# EasyEDA Pro project esp32-dev-board-v1.1.eprj

# Schematic Schematic1
Board Name: Board1; Create Date: 2025-04-14; Page Name: P1; Project Name: esp32-dev-board-v1.1; Schematic Name: Schematic1; Update Date: 2025-04-22; Company: 嘉立创EDA; Page Size: A4; Version: V1.0
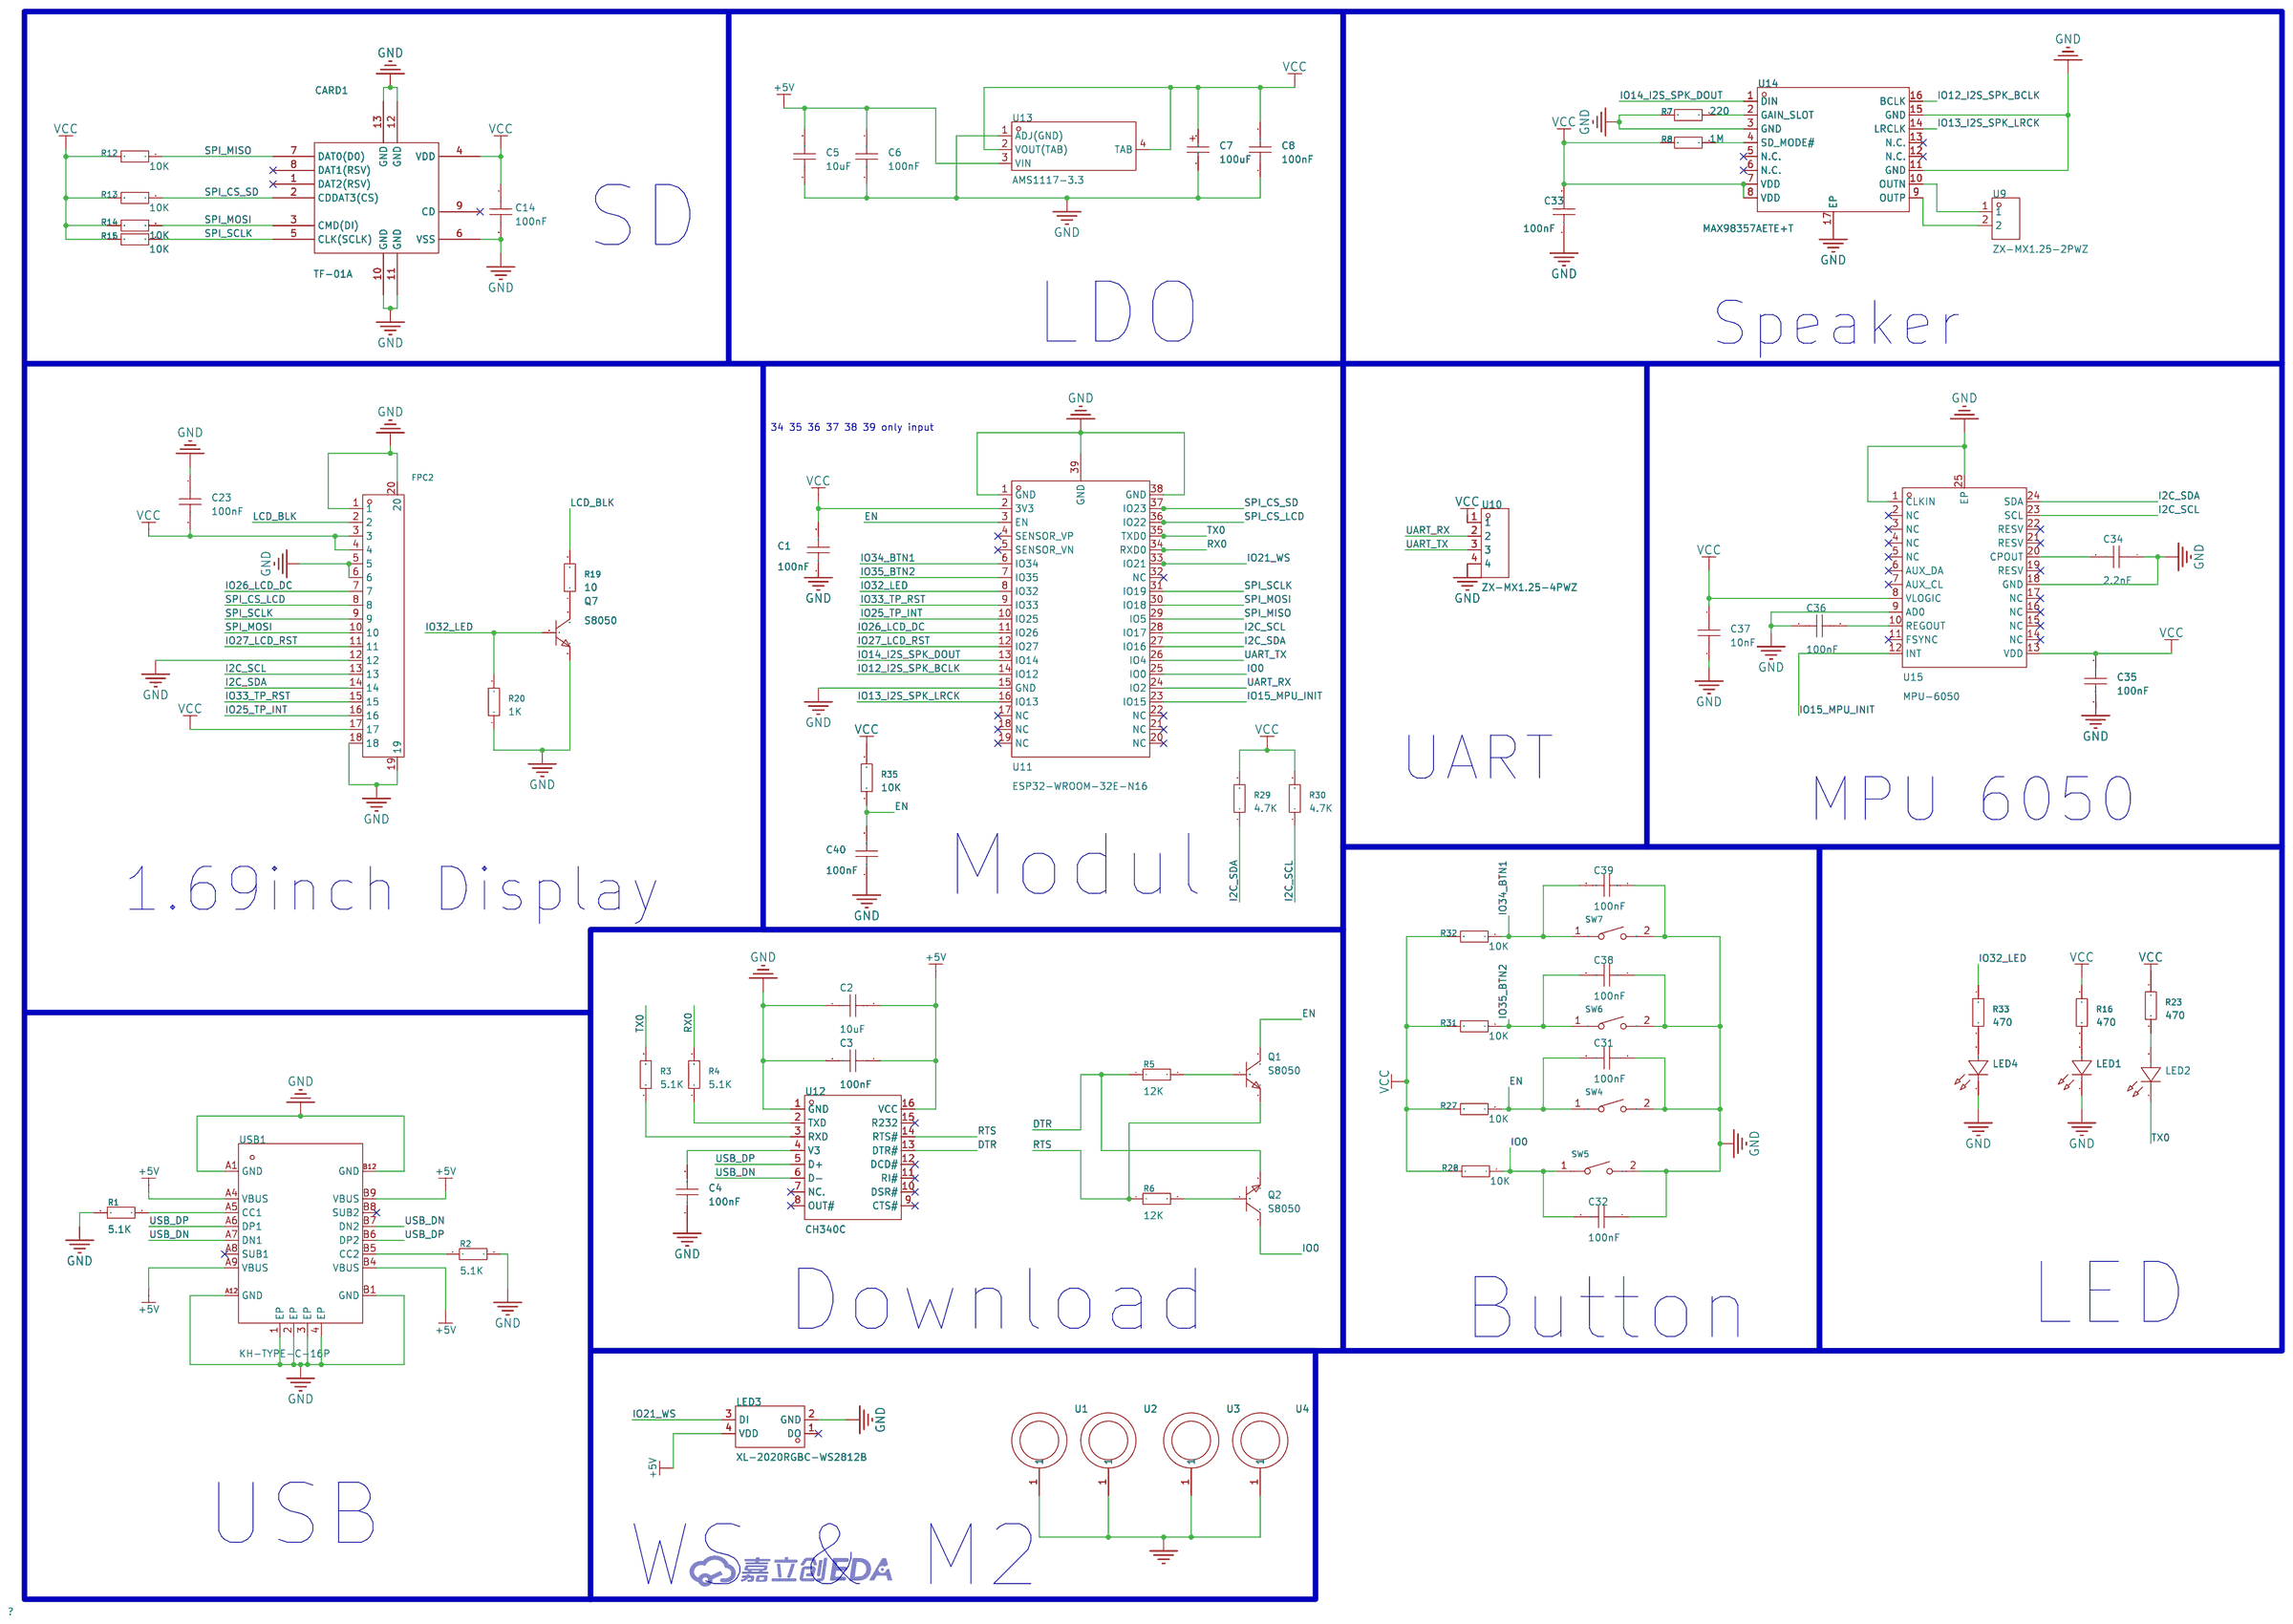
[diagram p0: schematic sheet]

## Parts
C1  100nF  [C0402]
C2  10uF  [C0603]
C3  100nF  [C0402]
C4  100nF  [C0402]
C5  10uF  [C0603]
C6  100nF  [C0402]
C7  100uF  [CASE-B_3528]
C8  100nF  [C0402]
C14  100nF  [C0402]
C23  100nF  [C0402]
C31  100nF  [C0402]
C32  100nF  [C0402]
C33  100nF  [C0402]
C34  2.2nF  [C0402]
C35  100nF  [C0402]
C36  100nF  [C0402]
C37  10nF  [C0402]
C38  100nF  [C0402]
C39  100nF  [C0402]
C40  100nF  [C0402]
CARD1  TF-01A  [TF-SMD_TF-01A]
FPC2  FPC-05F-18PH20  [FPC-SMD_18P-P0.50_FPC-05F-18PH20]
LED1  XL-1608SURC-06  [LED0603-RD_RED]
LED2  XL-1608SURC-06  [LED0603-RD_RED]
LED3  XL-2020RGBC-WS2812B  [LED-SMD_4P-L2.0-W2.0-BR-1]
LED4  XL-1608SURC-06  [LED0603-RD_RED]
Q1  S8050  [SOT-23-3_L2.9-W1.3-P1.90-LS2.3-BR]
Q2  S8050  [SOT-23-3_L2.9-W1.3-P1.90-LS2.3-BR]
Q7  S8050  [SOT-23-3_L2.9-W1.3-P1.90-LS2.3-BR]
R1  5.1K  [R0402]
R2  5.1K  [R0402]
R3  5.1K  [R0402]
R4  5.1K  [R0402]
R5  12K  [R0402]
R6  12K  [R0402]
R7  220  [R0402]
R8  1M  [R0402]
R12  10K  [R0402]
R13  10K  [R0402]
R14  10K  [R0402]
R15  10K  [R0402]
R16  470  [R0402]
R19  10  [R0402]
R20  1K  [R0402]
R23  470  [R0402]
R27  10K  [R0402]
R28  10K  [R0402]
R29  4.7K  [R0402]
R30  4.7K  [R0402]
R31  10K  [R0402]
R32  10K  [R0402]
R33  470  [R0402]
R35  10K  [R0402]
SW4  TS-1088-AR02016  [SW-SMD_L3.9-W3.0-P4.45]
SW5  TS-1088-AR02016  [SW-SMD_L3.9-W3.0-P4.45]
SW6  TS-1088-AR02016  [SW-SMD_L3.9-W3.0-P4.45]
SW7  TS-1088-AR02016  [SW-SMD_L3.9-W3.0-P4.45]
U1  -  [M2]
U2  -  [M2]
U3  -  [M2]
U4  -  [M2]
U9  ZX-MX1.25-2PWZ  [CONN-TH_2P-P1.25_ZX-MX1.25-2PWZ]
U10  ZX-MX1.25-4PWZ  [CONN-TH_4P-P1.25_ZX-MX1.25-4PWZ]
U11  ESP32-WROOM-32E-N16  [WIFI-SMD_ESP32-WROOM-32E]
U12  CH340C  [SOP-16_L10.0-W3.9-P1.27-LS6.0-BL]
U13  AMS1117-3.3  [SOT-223-4_L6.5-W3.5-P2.30-LS7.0-BR]
U14  MAX98357AETE+T  [TQFN-16_L3.0-W3.0-P0.50-BL-EP1.5]
U15  MPU-6050  [QFN-24_L4.0-W4.0-P0.50-BL-EP2.7]
USB1  KH-TYPE-C-16P  [USB-C-SMD_KH-TYPE-C-16P]

## Library data of the parts
C1 C3 C4 C6 C8 C14 C23 C31-C40 = CL05B104KO5NNNC: Capacitance: Tolerance:±10% Tolerance:±10% Voltage Rated: Temperature Coefficient:; LCSC Part Name: 100nF ±10% 16V; Supplier Part: C1525; Manufacturer: SAMSUNG(三星); Supplier Footprint: 0402; JLCPCB Part Class: Basic Part; Datasheet: https://atta.szlcsc.com/upload/public/pdf/source/20160218/1457707763339.pdf; Supplier: LCSC; Tolerance: ±10%
C2 C5 = CGA0603X5R106K100JT: Capacitance:10000000pF Tolerance:±10% Tolerance:±10% Voltage Rated: Temperature Coefficient:; LCSC Part Name: 10uF ±10% 10V; Supplier Part: C6119842; Manufacturer: HRE(芯声); Supplier Footprint: 0603; JLCPCB Part Class: Extended Part; Supplier: LCSC; Tolerance: ±10%
C7 = TAJB107K006RNJ: Capacitance: Tolerance:±10% Tolerance:±10% Rated Voltage: Equivalent Series Resistance(ESR):1.7Ω@100kHz Operating Temperature:-55℃~+125℃ Operating Temperature:-55℃~+125℃; LCSC Part Name: 100uF ±10% 6.3V; Supplier Part: C16133; Manufacturer: Kyocera AVX; Supplier Footprint: CASE-B-3528-21(mm); JLCPCB Part Class: Basic Part; Datasheet: https://atta.szlcsc.com/upload/public/pdf/source/20160107/1457707750344.pdf; Supplier: LCSC; Tolerance: ±10%; Equivalent Series Resistance(ESR): 1.7Ω@100kHz; Operating Temperature: -55℃~+125℃
CARD1 = TF-01A_C91145: Card Connection Mode:Self-bouncing Card Type:MicroSD card (TF card) Connector Type:Card Slot Additional Card Detection Pins:- Supplementary Features:With Locating Pin Maximum Body Height:1.85mm Operating Temperature Range:- Operating Temperature Range:-; LCSC Part Name: 自弹式 MicroSD卡(TF卡) 卡座; Supplier Part: C91145; Manufacturer: 韩国韩荣; Supplier Footprint: SMD; JLCPCB Part Class: Extended Part; Datasheet: https://atta.szlcsc.com/upload/public/pdf/source/20190322/C91145_63CBD6FB4639A3A3EC6A9721F18AE0FB.pdf; Supplier: LCSC; Card Connection Mode: Self-bouncing; Card Type: MicroSD card (TF card); Connector Type: Card Slot; Supplementary Features: With Locating Pin; Maximum Body Height: 1.85mm
FPC2 = FPC-05F-18PH20: Locking Feature:Clamshell Contact Type:Bottom Contact Number of Contacts:18P Pitch:0.5mm Mounting Type:卧贴 FFC, FCB Thickness:0.3mm FFC, FCB Thickness:0.3mm Height Above Board:2mm Operating Temperature Range:-25℃~+85℃ Operating Temperature Range:-25℃~+85℃; LCSC Part Name: 间距:0.5mm P数:18P 翻盖式 下接; Supplier Part: C2856802; Manufacturer: XUNPU(讯普); Supplier Footprint: SMD,P=0.5mm,卧贴; JLCPCB Part Class: Extended Part; Datasheet: https://atta.szlcsc.com/upload/public/pdf/source/20210922/C2856802_2A845D1961F33AEC1ED22CECB292335F.pdf; Supplier: LCSC; Locking Feature: Clamshell; Contact Type: Bottom Contact; Number of Contacts: 18P; Pitch: 0.5mm; Mounting Type: 卧贴; FFC, FCB Thickness: 0.3mm; Height Above Board: 2mm; Operating Temperature Range: -25℃~+85℃
LED1 LED2 LED4 = XL-1608SURC-06: Emitted Color:Red Power Dissipation:55mW Forward Current:25mA Dominant Wavelength:617nm~621nm Dominant Wavelength:617nm~621nm Peak Wavelength:623nm Lens Color:无色透明透镜 Color Temperature:- Color Temperature:- Viewing Angle:120° Mounting Sytle:Positive post O; Supplier Part: C965799; Manufacturer: XINGLIGHT(成兴光); Supplier Footprint: 0603; JLCPCB Part Class: Extended Part; Datasheet: https://atta.szlcsc.com/upload/public/pdf/source/20221102/D860AFDD1CDB02C5A8064103A32707E2.pdf; Supplier: LCSC; Emitted Color: Red; Power Dissipation: 55mW; Forward Current: 25mA; Dominant Wavelength: 617nm~621nm; Peak Wavelength: 623nm; Lens Color: 无色透明透镜; Viewing Angle: 120°; Mounting Sytle: Positive post; Operating Temperature: -30℃~+85℃
LED3 = XL-2020RGBC-WS2812B: Wavelength:620nm~625nm；470nm~475nm；525nm~530nm Luminous Intensity:150mcd；150mcd；400mcd Lens Color:Translucent Fog Lens Installation method:Positive Stick Operating Temperature:-20℃~+85℃; LCSC Part Name: 幻彩透明; Supplier Part: C5349955; Manufacturer: XINGLIGHT(成兴光); Supplier Footprint: 2020; JLCPCB Part Class: Extended Part; Datasheet: https://atta.szlcsc.com/upload/public/pdf/source/20230111/97A2D5930F183799801175706AF118AF.pdf; Supplier: LCSC; Wavelength: 620nm~625nm；470nm~475nm；525nm~530nm; Luminous Intensity: 150mcd；150mcd；400mcd; Lens Color: Translucent Fog Lens; Installation method: Positive Stick; Operating Temperature: -20℃~+85℃
Q1 Q2 = S8050_C20069125: Transistor Type: Collector Current (Ic): Collector-Emitter Breakdown Voltage (Vceo): Power Dissipation (Pd): DC Current Gain (hFE@Ic,Vce):120@50mA,1.0V DC Current Gain (hFE@Ic,Vce):120@50mA,1.0V Transition Frequency (fT):100MHz Collector Cut-Off Current (; LCSC Part Name: hFE:200-350，丝印:J3Y; Supplier Part: C20069125; Manufacturer: 宏迦橙; Supplier Footprint: SOT-23; JLCPCB Part Class: Extended Part; Datasheet: https://atta.szlcsc.com/upload/public/pdf/source/20240403/2D78449C96B6E27F13BF8BDF79E27159.pdf; Supplier: LCSC; DC Current Gain (hFE@Ic,Vce): 120@50mA,1.0V; Transition Frequency (fT): 100MHz; Collector Cut-Off Current (Icbo): 100nA; Collector-Emitter Saturation Voltage (VCE(sat)@Ic,Ib): 600mV@500mA,50mA; Operating Temperature: -55℃~+150℃
Q7 = S8050_C20069125: Transistor Type: Collector Current (Ic): Collector-Emitter Breakdown Voltage (Vceo): Power Dissipation (Pd): DC Current Gain (hFE@Ic,Vce):120@50mA,1.0V DC Current Gain (hFE@Ic,Vce):120@50mA,1.0V Transition Frequency (fT):100MHz Collector Cut-Off Current (; LCSC Part Name: hFE:200-350，丝印:J3Y; Supplier Part: C20069125; Manufacturer: 宏迦橙; Supplier Footprint: SOT-23; JLCPCB Part Class: Extended Part; Datasheet: https://atta.szlcsc.com/upload/public/pdf/source/20240403/2D78449C96B6E27F13BF8BDF79E27159.pdf; Supplier: LCSC; DC Current Gain (hFE@Ic,Vce): 120@50mA,1.0V; Transition Frequency (fT): 100MHz; Collector Cut-Off Current (Icbo): 100nA; Collector-Emitter Saturation Voltage (VCE(sat)@Ic,Ib): 600mV@500mA,50mA; Operating Temperature: -55℃~+150℃; type: NPN; Pd - Power Dissipation: 300mW; DC Current Gain: 120@50mA,1.0V; Transition frequency(fT): 100MHz; Current - Collector Cutoff: 100nA; Vce Saturation(VCE(sat)): 600mV
R1-R8 R12-R16 R19 R20 R23 R27-R33 R35 = 0402WGF4700TCE: Type:Thick Film Resistors Resistance: Tolerance:±1% Tolerance:±1% Power(Watts): Overload Voltage (Max): Temperature Coefficient:±100ppm/℃ Temperature Coefficient:±100ppm/℃ Operating Temperature Range:-55℃~+155℃ Operating Temperature Range:-55℃~+155℃; LCSC Part Name: 470Ω ±1% 62.5mW 厚膜电阻; Supplier Part: C25117; Manufacturer: UNI-ROYAL(厚声); Supplier Footprint: 0402; JLCPCB Part Class: Basic Part; Datasheet: https://atta.szlcsc.com/upload/public/pdf/source/20200306/C422600_1E6D84923E4A46A82E41ADD87F860B5C.pdf; Supplier: LCSC; Type: Thick Film Resistors; Tolerance: ±1%; Temperature Coefficient: ±100ppm/℃; Operating Temperature Range: -55℃~+155℃
SW4-SW7 = TS-1088-AR02016: Circuit:SPST Actuator Style:Round Button Operating Force:160gf Mounting Style:Brick nogging Switch Length:4mm Switch Width:3mm Switch Height:2mm Strike Gundam:不带 Contact Current:50mA Voltage Rating (DC):12V Insulation Resistance:100MΩ Actuator/Cap Color:B; LCSC Part Name: 4*3*2mm 立贴 轻触开关; Supplier Part: C720477; Manufacturer: XUNPU(讯普); Supplier Footprint: SMD; JLCPCB Part Class: Extended Part; Datasheet: https://atta.szlcsc.com/upload/public/pdf/source/20200810/C720475_60D09DD6C54279ADDB2DC25100F1CC11.pdf; Supplier: LCSC; Circuit: SPST; Actuator Style: Round Button; Operating Force: 160gf; Mounting Style: Brick nogging; Switch Length: 4mm; Switch Width: 3mm; Switch Height: 2mm; Strike Gundam: 不带; Contact Current: 50mA; Voltage Rating (DC): 12V; Insulation Resistance: 100MΩ; Actuator/Cap Color: Black; Pin Style: SMDSplicing; Mechanical Life: 10万次; Operating Temperature: -30℃~+80℃
U1-U4 = M2
U9 = ZX-MX1.25-2PWZ: Pins Structure:1x2P Pitch:1.25mm Mounting Style:Bend-in Reference Series:PicoBlade(MX 1.25) Number of Pins:2P Number of Rows:1 Number of PINs Per Row:2 Row Spacing:- Current Rating (Max):- Contact Material:Brass Contact Plating:Tin Operating Temperature R; LCSC Part Name: 1x2P 间距:1.25mm 弯插 系列:PicoBlade(MX 1.25) 配套胶壳型号：ZX-MX1.25-2PJK 配套端子型号：ZX-MX1.25-DZ 配套杜邦线型号：ZX-MX1.25-2PBXC; Supplier Part: C7430463; Manufacturer: Megastar(兆星); Supplier Footprint: 弯插,P=1.25mm; JLCPCB Part Class: Extended Part; Datasheet: https://atta.szlcsc.com/upload/public/pdf/source/20230619/EFC7482EB916E36F9EF0B03A9637C24F.pdf; Supplier: LCSC; Pins Structure: 1x2P; Pitch: 1.25mm; Mounting Style: Bend-in; Reference Series: PicoBlade(MX 1.25); Number of Pins: 2P; Number of Rows: 1; Number of PINs Per Row: 2; Contact Material: Brass; Contact Plating: Tin; Colour: White; Z-Height of the Board: 3.3mm; X-Length of Bottom Edge on Board (Spacing Line): 4.4mm; Y-Width of Bottom Edge on Board: 4.6mm
U10 = ZX-MX1.25-4PWZ: Pins Structure:1x4P Pitch:1.25mm Mounting Style:Bend-in Reference Series:PicoBlade(MX 1.25) Number of Pins:4P Number of Rows:1 Number of PINs Per Row:4 Row Spacing:- Current Rating (Max):- Contact Material:Brass Contact Plating:Tin Operating Temperature R; LCSC Part Name: 1x4P 间距:1.25mm 弯插 系列:PicoBlade(MX 1.25) 配套胶壳型号：ZX-MX1.25-4PJK 配套端子型号：ZX-MX1.25-DZ 配套杜邦线型号：ZX-MX1.25-4PBXC; Supplier Part: C7430465; Manufacturer: Megastar(兆星); Supplier Footprint: 弯插,P=1.25mm; JLCPCB Part Class: Extended Part; Datasheet: https://atta.szlcsc.com/upload/public/pdf/source/20230619/13E052D24268A9BEC4967A3768BAD5AA.pdf; Supplier: LCSC; Pins Structure: 1x4P; Pitch: 1.25mm; Mounting Style: Bend-in; Reference Series: PicoBlade(MX 1.25); Number of Pins: 4P; Number of Rows: 1; Number of PINs Per Row: 4; Contact Material: Brass; Contact Plating: Tin; Colour: White; Z-Height of the Board: 3.3mm; X-Length of Bottom Edge on Board (Spacing Line): 6.9mm; Y-Width of Bottom Edge on Board: 4.6mm
U11 = ESP32-WROOM-32E-N16_C701343: LCSC Part Name: 通用型Wi-Fi+BT+BLE MCU模组; Supplier Part: C701343; Manufacturer: ESPRESSIF(乐鑫); Supplier Footprint: SMD,18x25.5mm; JLCPCB Part Class: Extended Part; Datasheet: https://atta.szlcsc.com/upload/public/pdf/source/20241030/447B1C85FFE3FB0A37F75624F2C6635F.pdf; Supplier: LCSC
U12 = CH340C: Applications Function:Transceiver Protocol: Supply Voltage:3.3V；5V Supply Voltage:3.3V；5V Data Rate:2Mbps; LCSC Part Name: CH340C USB转串口芯片 CH340; Supplier Part: C84681; Manufacturer: WCH(南京沁恒); Supplier Footprint: SOP-16; JLCPCB Part Class: Extended Part; Datasheet: https://atta.szlcsc.com/upload/public/pdf/source/20240619/63986D8440D4E5267A77ACD891CC4DE3.pdf; Supplier: LCSC; Applications Function: Transceiver; Supply Voltage: 3.3V；5V; Data Rate: 2Mbps
U13 = AMS1117-3.3_C347222: Output Type:Fixed Maximum Input Voltage:12V Output Voltage:3.3V Output Voltage:3.3V Output Current:1A Power Supply Rejection Ratio (PSRR):60dB@(120Hz) Dropout Voltage:1.3V@(1A) standby current:- Noise:- Feature:Overcurrent Protection(OCP) Operating Temper; LCSC Part Name: 输出:3.3V 电流:1A 耐压:12V; Supplier Part: C347222; Manufacturer: UMW(友台半导体); Supplier Footprint: SOT-223; Datasheet: https://atta.szlcsc.com/upload/public/pdf/source/20241218/BAF0263FA2E44BCD8AF41AA4FA04EFAA.pdf; Supplier: LCSC; Output Type: Fixed; Maximum Input Voltage: 12V; Output Voltage: 3.3V; Output Current: 1A; Power Supply Rejection Ratio (PSRR): 60dB@(120Hz); Dropout Voltage: 1.3V@(1A); Feature: Overcurrent Protection(OCP); Output Polarity: Positive electrode; Number of Outputs: 1
U14 = MAX98357AETE+T: Type of Power Amplifier: Speaker Channels:Monaural Output Power: Supply Voltage:2.5V~5.5V Supply Voltage:2.5V~5.5V Operating Temperature:-40℃~+85℃ Operating Temperature:-40℃~+85℃; LCSC Part Name: 微型、低成本、PCM 类 D 级放大器具有 AB 级性能; Supplier Part: C910544; Manufacturer: ADI(亚德诺)/MAXIM(美信); Supplier Footprint: TQFN-16-EP(3x3); JLCPCB Part Class: Extended Part; Datasheet: https://atta.szlcsc.com/upload/public/pdf/source/20210106/C910544_CB6DE4B2CEE254A72E6BDB40E718D281.pdf; Supplier: LCSC; Speaker Channels: Monaural; Supply Voltage: 2.5V~5.5V; Operating Temperature: -40℃~+85℃
U15 = MPU-6050: Supplier Part: C24112; Manufacturer: TDK InvenSense(应美盛); Supplier Footprint: QFN-24-EP(4x4); JLCPCB Part Class: Extended Part; Datasheet: https://atta.szlcsc.com/upload/public/pdf/source/20140425/1457707046159.pdf; Supplier: LCSC; Sensor Type: 加速度计陀螺仪; Operating Temperature: -40℃~+85℃
USB1 = KH-TYPE-C-16P: Connector Type:Type-C Standard:- Gender:Female Number of Ports:1 Number of Contacts:16P Mounting Style:卧贴 Current Rating - Power (Max):3A Operating Temperature Range:-40℃~+85℃ Operating Temperature Range:-40℃~+85℃; LCSC Part Name: Type-C 母 卧贴; Supplier Part: C709357; Manufacturer: kinghelm(金航标); Supplier Footprint: SMD; JLCPCB Part Class: Extended Part; Datasheet: https://atta.szlcsc.com/upload/public/pdf/source/20200911/C709357_AA8DCEB38BB20E3035A7ED7AE7667837.pdf; Supplier: LCSC; Connector Type: Type-C; Gender: Female; Number of Ports: 1; Number of Contacts: 16P; Mounting Style: 卧贴; Current Rating - Power (Max): 3A; Operating Temperature Range: -40℃~+85℃

## Nets
+5V: C2.2 C3.1 C5.2 C6.1 LED3.4(VDD) U12.16(VCC) U13.3(VIN) USB1.A4(VBUS) USB1.A9(VBUS) USB1.B4(VBUS) USB1.B9(VBUS)
GND: C1.1 C2.1 C3.2 C4.1 C5.1 C6.2 C7.2 C8.1 C14.2 C23.1 C31.1 C32.1 C33.1 C34.1 C35.2 C36.1 C37.2 C38.1 C39.1 C40.1 CARD1.6(VSS) CARD1.10(GND) CARD1.11(GND) CARD1.12(GND) CARD1.13(GND) FPC2.1 FPC2.5 FPC2.6 FPC2.12 FPC2.18 FPC2.19 FPC2.20 LED1.1(K) LED3.2(GND) LED4.1(K) Q7.2(E) R1.1 R2.2 R7.2 R20.1 SW4.2 SW5.2 SW6.2 SW7.2 U1.1 U2.1 U3.1 U4.1 U10.4 U11.1(GND) U11.15(GND) U11.38(GND) U11.39(GND) U12.1(GND) U13.1(ADJ(GND)) U14.3(GND) U14.11(GND) U14.15(GND) U14.17(EP) U15.1(CLKIN) U15.9(AD0) U15.18(GND) U15.25(EP) USB1.1(EP) USB1.2(EP) USB1.3(EP) USB1.4(EP) USB1.A1(GND) USB1.A12(GND) USB1.B1(GND) USB1.B12(GND)
VCC: C1.2 C7.1 C8.2 C14.1 C23.2 C33.2 C35.1 C37.1 CARD1.4(VDD) FPC2.3 FPC2.4 FPC2.17 R8.2 R12.2 R13.2 R14.2 R15.2 R16.1 R23.1 R27.2 R28.2 R29.2 R30.2 R31.2 R32.2 R35.2 U10.1 U11.2(3V3) U13.2(VOUT(TAB)) U13.4(TAB) U14.7(VDD) U14.8(VDD) U15.8(VLOGIC) U15.13(VDD)
DTR: Q2.2(E) R5.1 U12.13(DTR#)
EN: C31.2 C40.2 Q1.3(C) R27.1 R35.1 SW4.1 U11.3(EN)
I2C_SCL: FPC2.13 R30.1 U11.28(IO17) U15.23(SCL)
I2C_SDA: FPC2.14 R29.1 U11.27(IO16) U15.24(SDA)
IO0: C32.2 Q2.3(C) R28.1 SW5.1 U11.25(IO0)
IO12_I2S_SPK_BCLK: U11.14(IO12) U14.16(BCLK)
IO13_I2S_SPK_LRCK: U11.16(IO13) U14.14(LRCLK)
IO14_I2S_SPK_DOUT: U11.13(IO14) U14.1(DIN)
IO15_MPU_INIT: U11.23(IO15) U15.12(INT)
IO21_WS: LED3.3(DI) U11.33(IO21)
IO25_TP_INT: FPC2.16 U11.10(IO25)
IO26_LCD_DC: FPC2.7 U11.11(IO26)
IO27_LCD_RST: FPC2.11 U11.12(IO27)
IO32_LED: Q7.1(B) R20.2 R33.1 U11.8(IO32)
IO33_TP_RST: FPC2.15 U11.9(IO33)
IO34_BTN1: C39.2 R32.1 SW7.1 U11.6(IO34)
IO35_BTN2: C38.2 R31.1 SW6.1 U11.7(IO35)
LCD_BLK: FPC2.2 R19.2
RTS: Q1.2(E) R6.1 U12.14(RTS#)
RX0: R4.2 U11.34(RXD0)
SPI_CS_LCD: FPC2.8 U11.36(IO22)
SPI_CS_SD: CARD1.2(CDDAT3(CS)) R13.1 U11.37(IO23)
SPI_MISO: CARD1.7(DAT0(D0)) R12.1 U11.29(IO5)
SPI_MOSI: CARD1.3(CMD(DI)) FPC2.10 R14.1 U11.30(IO18)
SPI_SCLK: CARD1.5(CLK(SCLK)) FPC2.9 R15.1 U11.31(IO19)
TX0: LED2.1(K) R3.2 U11.35(TXD0)
UART_RX: U10.2 U11.24(IO2)
UART_TX: U10.3 U11.26(IO4)
USB_DN: U12.6(D-) USB1.A7(DN1) USB1.B7(DN2)
USB_DP: U12.5(D+) USB1.A6(DP1) USB1.B6(DP2)
$1N1374: R4.1 U12.2(TXD)
$1N1375: R3.1 U12.3(RXD)
$1N1380: C4.2 U12.4(V3)
$1N1392: Q1.1(B) R5.2
$1N1393: Q2.1(B) R6.2
$1N4073: Q7.3(C) R19.1
$1N4390: R7.1 U14.2(GAIN_SLOT)
$1N4392: R8.1 U14.4(SD_MODE#)
$1N4396: U9.1 U14.10(OUTN)
$1N4397: U9.2 U14.9(OUTP)
$1N4657: C34.2 U15.20(CPOUT)
$1N4869: C36.2 U15.10(REGOUT)
Net-(LED1-2): LED1.2(A) R16.2
Net-(LED2-2): LED2.2(A) R23.2
Net-(LED4-2): LED4.2(A) R33.2
Net-(R1-2): R1.2 USB1.A5(CC1)
Net-(R2-1): R2.1 USB1.B5(CC2)

Not connected (* = marked no-connect by the designer): CARD1 1(DAT2(RSV))* 8(DAT1(RSV))* 9(CD)*; LED3 1(DO)*; U11 4(SENSOR_VP)* 5(SENSOR_VN)* 17(NC)* 18(NC)* 19(NC)* 20(NC)* 21(NC)* 22(NC)* 32(NC)*; U12 7(NC.)* 8(OUT#)* 9(CTS#)* 10(DSR#)* 11(RI#)* 12(DCD#)* 15(R232)*; U14 5(N.C.)* 6(N.C.)* 12(N.C.)* 13(N.C.)*; U15 2(NC)* 3(NC)* 4(NC)* 5(NC)* 6(AUX_DA)* 7(AUX_CL)* 11(FSYNC)* 14(NC)* 15(NC)* 16(NC)* 17(NC)* 19(RESV)* 21(RESV)* 22(RESV)*; USB1 A8(SUB1)* B8(SUB2)*

## Notes on the sheet
- SD
- LDO
- Speaker
- 34 35 36 37 38 39 only input
- UART
- MPU 6050
- 1.69inch Display
- Modul
- Download
- LED
- Button
- USB
- WS & M2

# Board PCB1
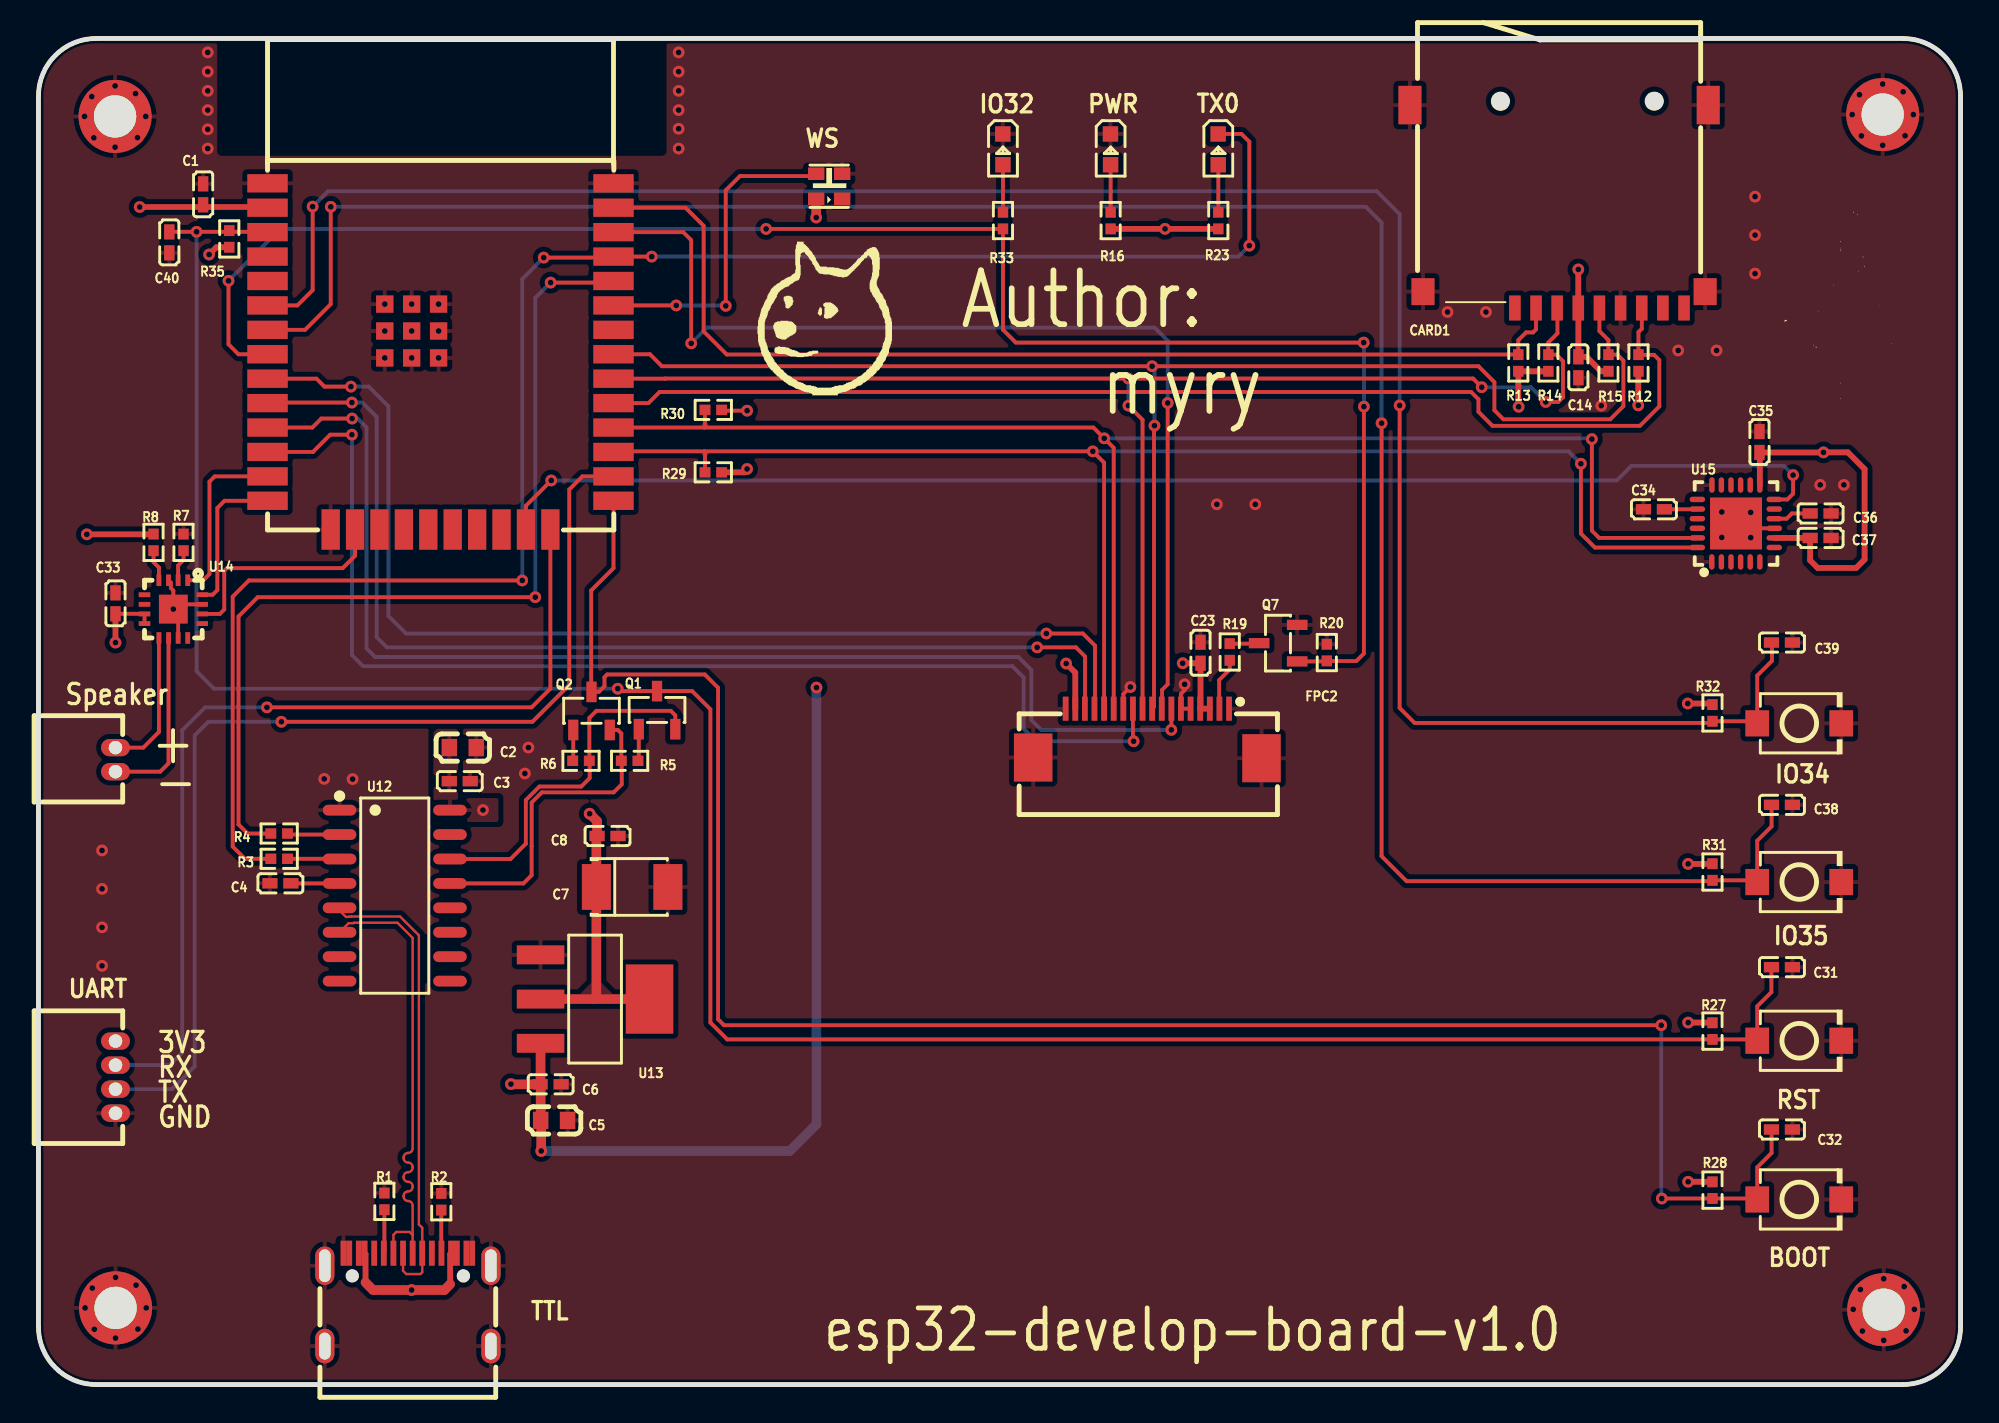
[diagram p1: board, top side]
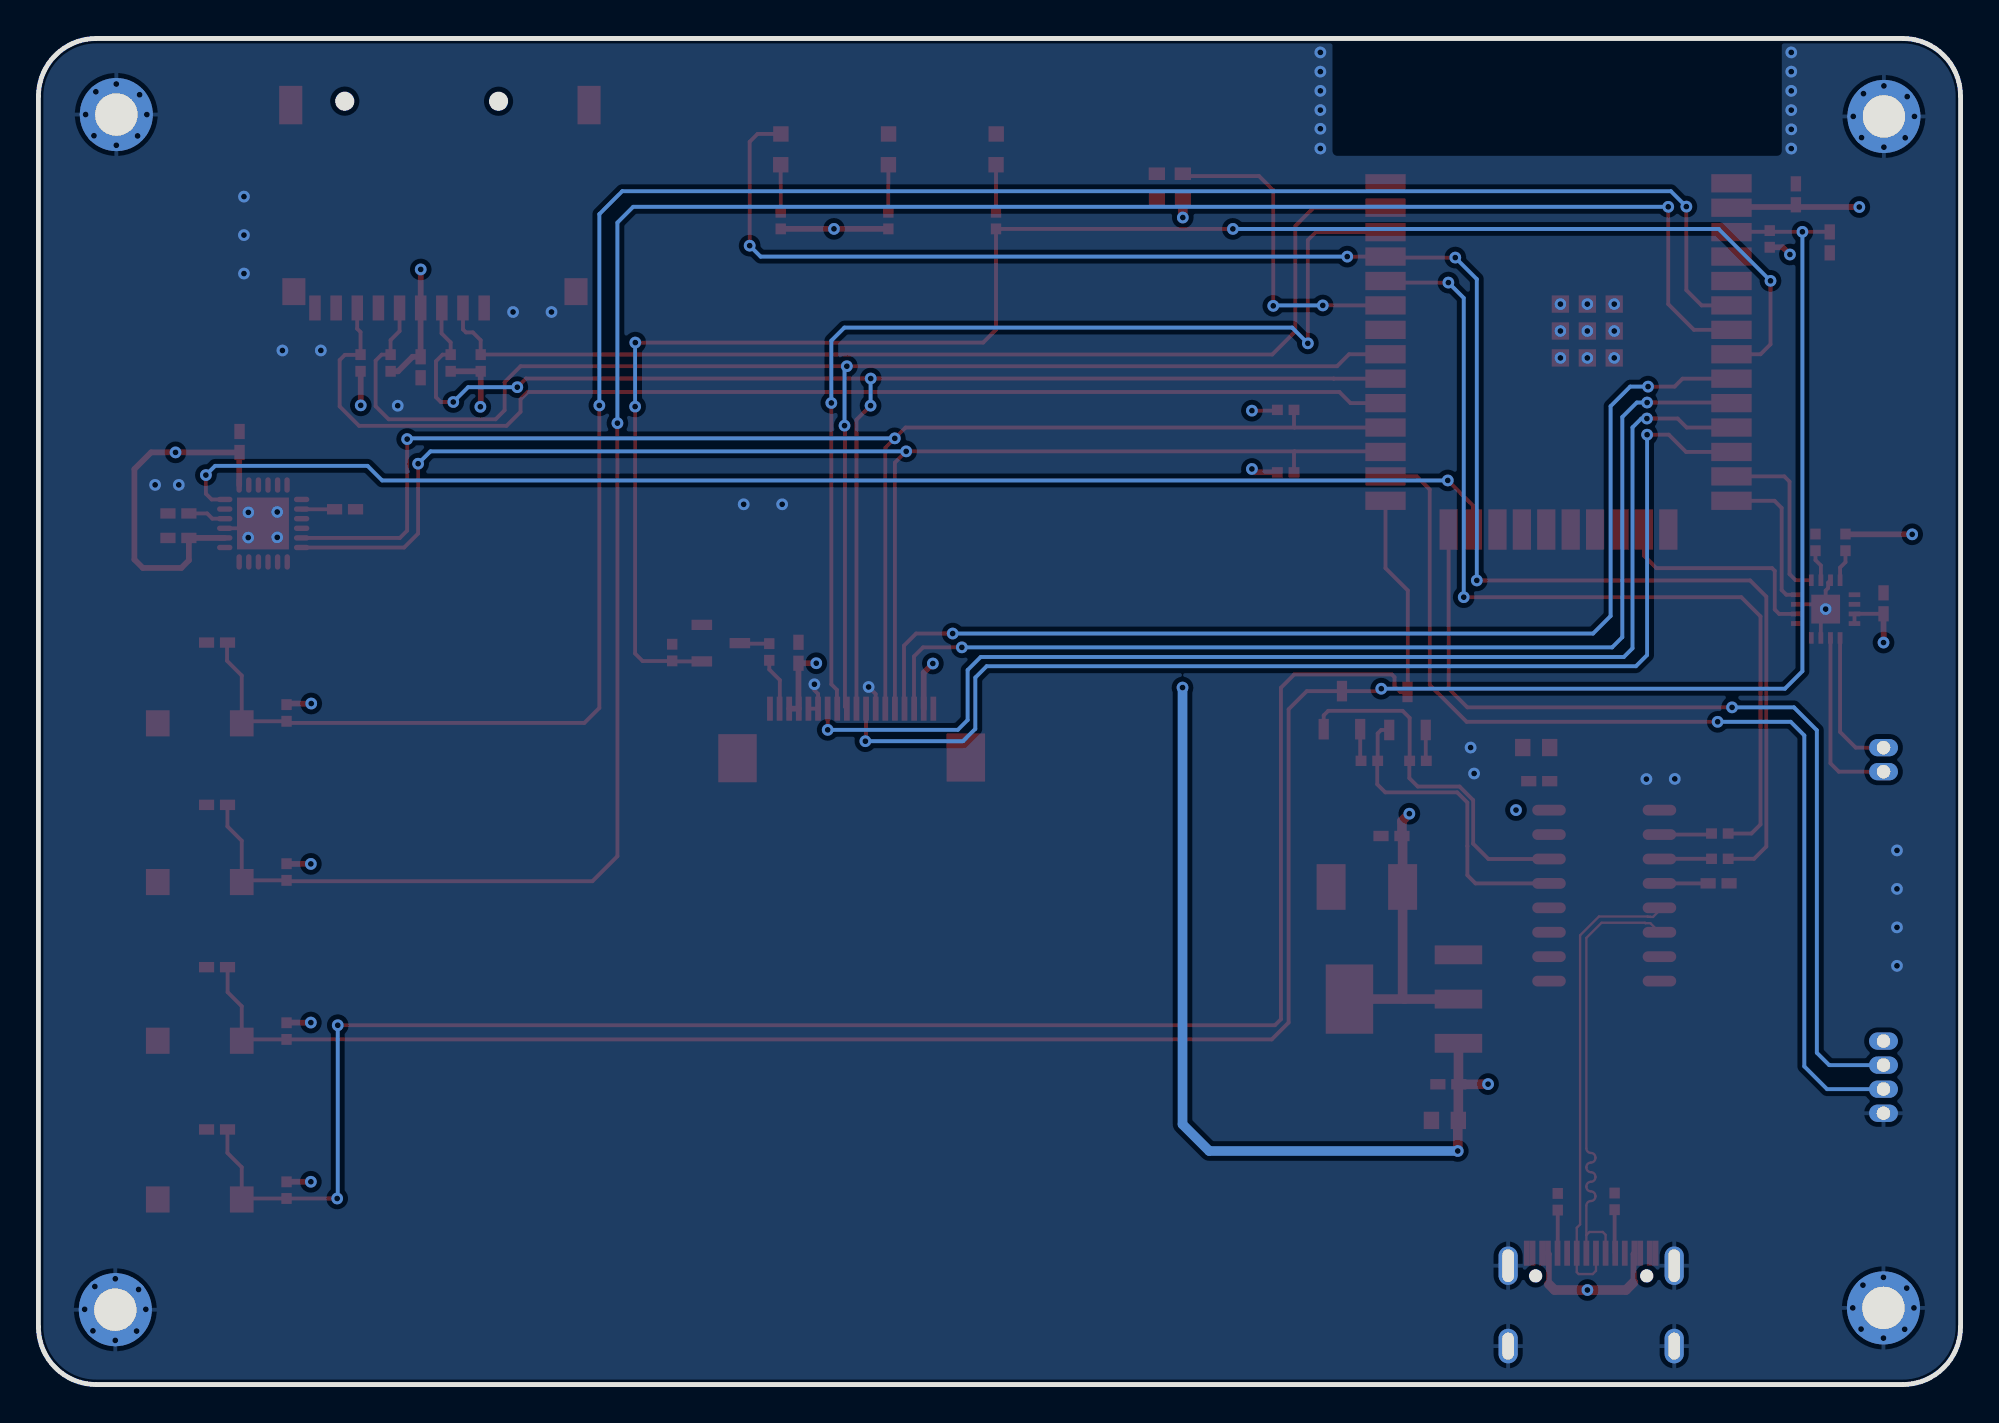
[diagram p2: board, bottom side, seen from below]

Outline 100 x 70 mm; copper layers: Top Layer, GND, PWR, Bottom Layer. Coordinates in mm from the lower left corner of the outline.
Outline path: 0,67 0,3 arc(0.88,0.88) 3,0 97,0 arc(99.12,0.88) 100,3 100,67 arc(99.12,69.12) 97,70 3,70 arc(0.88,69.12) 0,67
Stack: Top Layer 0.035mm Outer layer copper thickness 1oz / Dielectric1 0.2104mm 7628 RC49% 8.6mil / GND 0.0152mm Inner layer copper thickness / Dielectric2 1.065mm 1.1mm H/HOZ Copper / PWR 0.0152mm Inner layer copper thickness / Dielectric3 0.2104mm 7628 RC49% 8.6mil / Bottom Layer 0.035mm Outer layer copper thickness 1oz

## Design rules (mm)
net USB_DP: DP1
net USB_DN: DP1
template: Custom Config
spacing copperThickness1oz (default): track to track 0.102, other pairs 0.152 to 0.3
spacing copperThickness2oz: track to track 0.203, other pairs 0.152 to 0.3
track width copperThickness1oz (default): min 0.127, default 0.2, max 2.54
track width copperThickness2oz: min 0.203, default 0.254, max 2.54
differential pair differentialPair (default): width min 0.122, default 0.122, max 0.122; gap min 0.203, default 0.203
via viaSize (default): diameter min 0.5, default 0.61, max 10; hole min 0.3, default 0.305, max 6.3

## Placement (name value [footprint] x y rotation side)
BOOT  TS-1088-AR02016  [SW-SMD_L3.9-W3.0-P4.45]  91.61 9.62 0 top
C1  100nF  [C0402]  8.57 61.9 270 top
C2  10uF  [C0603]  22.08 33.12 180 top
C3  100nF  [C0402]  21.92 31.38 0 top
C4  100nF  [C0402]  12.59 26.07 0 top
C5  10uF  [C0603]  26.83 13.73 180 top
C6  100nF  [C0402]  26.65 15.61 0 top
C7  100uF  [CASE-B_3528]  30.89 25.88 0 top
C8  100nF  [C0402]  29.61 28.53 180 top
C14  100nF  [C0402]  80.12 52.9 270 top
C23  100nF  [C0402]  60.46 38.06 270 top
C31  100nF  [C0402]  90.71 21.71 180 top
C32  100nF  [C0402]  90.71 13.27 180 top
C33  100nF  [C0402]  4.01 40.62 270 top
C34  2.2nF  [C0402]  84.05 45.52 0 top
C35  100nF  [C0402]  89.54 49.02 90 top
C36  100nF  [C0402]  92.72 45.3 180 top
C37  10nF  [C0402]  92.72 44.03 0 top
C38  100nF  [C0402]  90.71 30.15 180 top
C39  100nF  [C0402]  90.71 38.59 180 top
C40  100nF  [C0402]  6.81 59.4 90 top
CARD1  TF-01A  [TF-SMD_TF-01A]  79.11 61.26 180 top
FPC2  FPC-05F-18PH20  [FPC-SMD_18P-P0.50_FPC-05F-18PH20]  57.69 33.86 0 top
IO32  XL-1608SURC-06  [LED0603-RD_RED]  50.17 64.23 270 top
IO34  TS-1088-AR02016  [SW-SMD_L3.9-W3.0-P4.45]  91.61 34.39 0 top
IO35  TS-1088-AR02016  [SW-SMD_L3.9-W3.0-P4.45]  91.61 26.13 0 top
PWR  XL-1608SURC-06  [LED0603-RD_RED]  55.78 64.23 270 top
Q1  S8050  [SOT-23-3_L2.9-W1.3-P1.90-LS2.3-BR]  32.18 35.07 270 top
Q2  S8050  [SOT-23-3_L2.9-W1.3-P1.90-LS2.3-BR]  28.77 35.03 270 top
Q7  S8050  [SOT-23-3_L2.9-W1.3-P1.90-LS2.3-BR]  64.5 38.56 0 top
R1  5.1K  [R0402]  18 9.53 270 top
R2  5.1K  [R0402]  20.96 9.5 90 top
R3  5.1K  [R0402]  12.52 27.34 180 top
R4  5.1K  [R0402]  12.52 28.66 180 top
R5  12K  [R0402]  30.76 32.44 0 top
R6  12K  [R0402]  28.23 32.44 180 top
R7  220  [R0402]  7.55 43.8 90 top
R8  1M  [R0402]  5.99 43.8 90 top
R12  10K  [R0402]  83.24 53.12 270 top
R13  10K  [R0402]  76.99 53.12 270 top
R14  10K  [R0402]  78.55 53.12 270 top
R15  10K  [R0402]  81.68 53.12 270 top
R16  470  [R0402]  55.78 60.53 90 top
R19  10  [R0402]  61.98 38.09 270 top
R20  1K  [R0402]  67.03 38.07 270 top
R23  470  [R0402]  61.38 60.53 90 top
R27  10K  [R0402]  87.09 18.38 90 top
R28  10K  [R0402]  87.09 10.11 90 top
R29  4.7K  [R0402]  35.11 47.44 0 top
R30  4.7K  [R0402]  35.11 50.69 0 top
R31  10K  [R0402]  87.09 26.65 90 top
R32  10K  [R0402]  87.09 34.93 90 top
R33  470  [R0402]  50.18 60.53 90 top
R35  10K  [R0402]  9.93 59.58 270 top
RST  TS-1088-AR02016  [SW-SMD_L3.9-W3.0-P4.45]  91.61 17.88 0 top
TTL  KH-TYPE-C-16P  [USB-C-SMD_KH-TYPE-C-16P]  19.22 4.41 0 top
TX0  XL-1608SURC-06  [LED0603-RD_RED]  61.38 64.23 270 top
U1  -  [M2]  95.95 66.04 0 top
U2  -  [M2]  96 3.89 0 top
U3  -  [M2]  4.01 3.99 0 top
U4  -  [M2]  3.99 65.95 0 top
U9  ZX-MX1.25-2PWZ  [CONN-TH_2P-P1.25_ZX-MX1.25-2PWZ]  4.01 32.5 270 top
U11  ESP32-WROOM-32E-N16  [WIFI-SMD_ESP32-WROOM-32E]  20.92 53.47 270 top
U12  CH340C  [SOP-16_L10.0-W3.9-P1.27-LS6.0-BL]  18.54 25.43 270 top
U13  AMS1117-3.3  [SOT-223-4_L6.5-W3.5-P2.30-LS7.0-BR]  28.96 20.05 180 top
U14  MAX98357AETE+T  [TQFN-16_L3.0-W3.0-P0.50-BL-EP1.5]  7.02 40.33 180 top
U15  MPU-6050  [QFN-24_L4.0-W4.0-P0.50-BL-EP2.7]  88.31 44.78 0 top
UART  ZX-MX1.25-4PWZ  [CONN-TH_4P-P1.25_ZX-MX1.25-4PWZ]  4.01 15.98 270 top
WS  XL-2020RGBC-WS2812B  [LED-SMD_4P-L2.0-W2.0-BR-1]  41.14 62.32 0 top

## Footprints (pads in the part's own frame, mm; a bottom-side part is the same pattern mirrored in y, then rotated)
C0402
  rect 0.79x0.54 smd: 1(-0.545,0) 2(0.545,0)
C0603
  rect 0.8x0.9 smd: 1(-0.7,0) 2(0.7,0)
CASE-B_3528
  rect 1.506x2.376 smd: 1(-1.861,0) 2(1.861,0)
CONN-TH_2P-P1.25_ZX-MX1.25-2PWZ
  oval 0.9x1.5 hole 0.7: 1(0.625,0) 2(-0.625,0)
CONN-TH_4P-P1.25_ZX-MX1.25-4PWZ
  oval 0.9x1.5 hole 0.7: 1(-1.875,0) 2(-0.625,0) 3(0.625,0) 4(1.875,0)
FPC-SMD_18P-P0.50_FPC-05F-18PH20
  rect 0.3x1.25 smd: 1(4.25,1.288) 2(3.75,1.288) 3(3.25,1.288) 4(2.75,1.288) 5(2.25,1.288) 6(1.75,1.288) 7(1.25,1.288) 8(0.75,1.288) 9(0.25,1.288) 10(-0.25,1.288) 11(-0.75,1.288) 12(-1.25,1.288) 13(-1.75,1.288) 14(-2.25,1.288) 15(-2.75,1.288) 16(-3.25,1.288) 17(-3.75,1.288) 18(-4.25,1.288)
  rect 2x2.5 smd: 19(5.94,-1.288) 20(-5.94,-1.252)
LED0603-RD_RED
  rect 0.8x0.8 smd: 1(-0.799,-0.004) 2(0.799,0.004)
LED-SMD_4P-L2.0-W2.0-BR-1
  rect 0.85x0.65 smd: 1(0.675,-0.65) 2(0.675,0.65) 3(-0.675,0.65) 4(-0.675,-0.65)
M2
  round 3.8 hole 2.2: 1(0,0)
QFN-24_L4.0-W4.0-P0.50-BL-EP2.7
  oval 0.28x0.8 smd: 1(-1.25,-2) 2(-0.75,-2) 3(-0.25,-2) 4(0.25,-2) 5(0.75,-2) 6(1.25,-2) 13(1.25,2) 14(0.75,2) 15(0.25,2) 16(-0.25,2) 17(-0.75,2) 18(-1.242,2)
  oval 0.8x0.28 smd: 7(2,-1.25) 8(2,-0.75) 9(2,-0.25) 10(2,0.25) 11(2,0.75) 12(2,1.25) 19(-2,1.25) 20(-2,0.75) 21(-2,0.25) 22(-2,-0.25) 23(-2,-0.75) 24(-2,-1.25)
  rect 2.7x2.7 smd: 25(0.013,0)
R0402
  rect 0.566x0.54 smd: 1(-0.433,0) 2(0.433,0)
SOP-16_L10.0-W3.9-P1.27-LS6.0-BL
  oval 0.56x1.745 smd: 1(-4.445,-2.873) 2(-3.175,-2.873) 3(-1.905,-2.873) 4(-0.635,-2.873) 5(0.635,-2.873) 6(1.905,-2.873) 7(3.175,-2.873) 8(4.445,-2.873) 9(4.445,2.873) 10(3.175,2.873) 11(1.905,2.873) 12(0.635,2.873) 13(-0.635,2.873) 14(-1.905,2.873) 15(-3.175,2.873) 16(-4.445,2.873)
SOT-23-3_L2.9-W1.3-P1.90-LS2.3-BR
  rect 1.07x0.532 smd: 1(0.99,-0.95) 2(0.99,0.95) 3(-0.99,0)
SOT-223-4_L6.5-W3.5-P2.30-LS7.0-BR
  rect 2.47x0.98 smd: 1(2.835,-2.3) 2(2.835,0) 3(2.835,2.3)
  rect 2.47x3.6 smd: 4(-2.835,0)
SW-SMD_L3.9-W3.0-P4.45
  rect 1.23x1.36 smd: 1(-2.185,0) 2(2.185,0)
TF-SMD_TF-01A
  rect 0.6x1.3 smd: 1(2.3,5.276) 2(1.2,5.276) 3(0.101,5.276) 4(-1,5.276) 5(-2.099,5.276) 6(-3.2,5.276) 7(-4.3,5.276) 8(-5.399,5.276) 9(-6.5,5.276)
  rect 1.2x1.4 smd: 10(-7.599,4.426) 13(7.08,4.426)
  rect 1.2x2 smd: 11(-7.76,-5.276) 12(7.76,-5.276)
TQFN-16_L3.0-W3.0-P0.50-BL-EP1.5
  rect 0.25x0.6 smd: 1(-0.749,-1.5) 2(-0.248,-1.5) 3(0.252,-1.5) 4(0.751,-1.5) 9(0.75,1.5) 10(0.25,1.5) 11(-0.25,1.5) 12(-0.749,1.5)
  rect 0.6x0.25 smd: 5(1.5,-0.748) 6(1.5,-0.248) 7(1.5,0.252) 8(1.5,0.752) 13(-1.5,0.752) 14(-1.5,0.252) 15(-1.5,-0.248) 16(-1.5,-0.748)
  rect 1.5x1.5 smd: 17(0,0)
USB-C-SMD_KH-TYPE-C-16P
  oval 1x2 hole 0.6x1.7: 1(-4.32,1.765) 2(4.32,1.765)
  oval 1x1.8 hole 0.6x1.4: 3(-4.32,-2.415) 4(4.32,-2.415)
  rect 0.3x1.3 smd: A1(-3.35,2.415) A4(-2.55,2.415) A5(-1.25,2.415) A6(-0.25,2.415) A7(0.25,2.415) A8(1.25,2.415) A9(2.55,2.415) A12(3.35,2.415) B1(3.05,2.415) B4(2.25,2.415) B5(1.75,2.415) B6(0.75,2.415) B7(-0.75,2.415) B8(-1.75,2.415) B9(-2.25,2.415) B12(-3.05,2.415)
WIFI-SMD_ESP32-WROOM-32E
  rect 0.95x2.1 smd: 1(-9.002,-9) 2(-7.732,-9) 3(-6.463,-9) 4(-5.192,-9) 5(-3.922,-9) 6(-2.652,-9) 7(-1.383,-9) 8(-0.113,-9) 9(1.157,-9) 10(2.428,-9) 11(3.697,-9) 12(4.968,-9) 13(6.237,-9) 14(7.508,-9) 25(7.508,9) 26(6.237,9) 27(4.968,9) 28(3.697,9) 29(2.428,9) 30(1.157,9) 31(-0.113,9) 32(-1.383,9) 33(-2.652,9) 34(-3.922,9) 35(-5.192,9) 36(-6.463,9) 37(-7.732,9) 38(-9.002,9)
  rect 2.1x0.95 smd: 15(9.002,-5.715) 16(9.002,-4.445) 17(9.002,-3.175) 18(9.002,-1.905) 19(9.002,-0.635) 20(9.002,0.635) 21(9.002,1.905) 22(9.002,3.175) 23(9.002,4.445) 24(9.002,5.715)
  rect 0.9x0.9 smd: 39(-2.721,-0.1) 39(-2.721,-1.5) 39(-2.721,-2.9) 39(-1.321,-0.1) 39(-1.321,-1.5) 39(-1.321,-2.9) 39(0.079,-0.1) 39(0.079,-1.5) 39(0.079,-2.9)

## Nets
+5V: C2.2 C3.1 C5.2 C6.1 TTL.A4 TTL.A9 TTL.B4 TTL.B9 U12.16 U13.3 WS.4
GND: BOOT.2 C1.1 C2.1 C3.2 C4.1 C5.1 C6.2 C7.2 C8.1 C14.2 C23.1 C31.1 C32.1 C33.1 C34.1 C35.2 C36.1 C37.2 C38.1 C39.1 C40.1 CARD1.6 CARD1.10 CARD1.11 CARD1.12 CARD1.13 FPC2.1 FPC2.5 FPC2.6 FPC2.12 FPC2.18 FPC2.19 FPC2.20 IO32.1 IO34.2 IO35.2 PWR.1 Q7.2 R1.1 R2.2 R7.2 R20.1 RST.2 TTL.1 TTL.2 TTL.3 TTL.4 TTL.A1 TTL.A12 TTL.B1 TTL.B12 U1.1 U2.1 U3.1 U4.1 U11.1 U11.15 U11.38 U11.39 U12.1 U13.1 U14.3 U14.11 U14.15 U14.17 U15.1 U15.9 U15.18 U15.25 UART.4 WS.2
VCC: C1.2 C7.1 C8.2 C14.1 C23.2 C33.2 C35.1 C37.1 CARD1.4 FPC2.3 FPC2.4 FPC2.17 R8.2 R12.2 R13.2 R14.2 R15.2 R16.1 R23.1 R27.2 R28.2 R29.2 R30.2 R31.2 R32.2 R35.2 U11.2 U13.2 U13.4 U14.7 U14.8 U15.8 U15.13 UART.1
DTR: Q2.2 R5.1 U12.13
EN: C31.2 C40.2 Q1.3 R27.1 R35.1 RST.1 U11.3
I2C_SCL: FPC2.13 R30.1 U11.28 U15.23
I2C_SDA: FPC2.14 R29.1 U11.27 U15.24
IO0: BOOT.1 C32.2 Q2.3 R28.1 U11.25
IO12_I2S_SPK_BCLK: U11.14 U14.16
IO13_I2S_SPK_LRCK: U11.16 U14.14
IO14_I2S_SPK_DOUT: U11.13 U14.1
IO15_MPU_INIT: U11.23 U15.12
IO21_WS: U11.33 WS.3
IO25_TP_INT: FPC2.16 U11.10
IO26_LCD_DC: FPC2.7 U11.11
IO27_LCD_RST: FPC2.11 U11.12
IO32_LED: Q7.1 R20.2 R33.1 U11.8
IO33_TP_RST: FPC2.15 U11.9
IO34_BTN1: C39.2 IO34.1 R32.1 U11.6
IO35_BTN2: C38.2 IO35.1 R31.1 U11.7
LCD_BLK: FPC2.2 R19.2
RTS: Q1.2 R6.1 U12.14
RX0: R4.2 U11.34
SPI_CS_LCD: FPC2.8 U11.36
SPI_CS_SD: CARD1.2 R13.1 U11.37
SPI_MISO: CARD1.7 R12.1 U11.29
SPI_MOSI: CARD1.3 FPC2.10 R14.1 U11.30
SPI_SCLK: CARD1.5 FPC2.9 R15.1 U11.31
TX0: R3.2 TX0.1 U11.35
UART_RX: U11.24 UART.2
UART_TX: U11.26 UART.3
USB_DN: TTL.A7 TTL.B7 U12.6
USB_DP: TTL.A6 TTL.B6 U12.5
$1N1362: R1.2 TTL.A5
$1N1363: R2.1 TTL.B5
$1N1374: R4.1 U12.2
$1N1375: R3.1 U12.3
$1N1380: C4.2 U12.4
$1N1392: Q1.1 R5.2
$1N1393: Q2.1 R6.2
$1N2490: R23.2 TX0.2
$1N2494: PWR.2 R16.2
$1N4073: Q7.3 R19.1
$1N4390: R7.1 U14.2
$1N4392: R8.1 U14.4
$1N4396: U9.1 U14.10
$1N4397: U9.2 U14.9
$1N4657: C34.2 U15.20
$1N4869: C36.2 U15.10
$1N6267: IO32.2 R33.2

Pads without a net: CARD1 1 8 9; TTL A8 B8; U11 4 5 17 18 19 20 21 22 32; U12 7 8 9 10 11 12 15; U14 5 6 12 13; U15 2 3 4 5 6 7 11 14 15 16 17 19 21 22; WS 1

## Via types
v1: diameter 0.61, hole 0.305, Top Layer to Bottom Layer, 148 vias

## Routing (per net, layer and track width the routed paths; a pad name or vN(x,y) marks a point on that pad's centre or on a via; arc(x,y) is an arc through that point)
+5V: length 109
  Top Layer w0.3: 21.47,6.83 21.42,6.78 21.42,5.22 ; 16.97,6.83 17.02,6.78 17.02,5.31
  Top Layer w0.5: U13.3 26.12,15.63 C6.1 ; 21.42,5.22 21.12,4.91 v1(19.41,4.91) 17.41,4.91 17.02,5.31 ; C6.1 24.59,15.61 v1(24.58,15.62) ; C6.1 26.13,15.59 C5.2 26.16,13.71 v1(26.16,12.15) ; WS.4 v1(40.46,60.69)
  PWR w0.5: v1(40.46,60.69) 40.46,36.26 v1(40.48,36.25) ; v1(24.58,15.62) 23.13,17.08 v1(23.13,29.88) ; v1(26.16,12.15) 26.16,4.3 25.34,3.47 19.95,3.47 19.41,4.01 v1(19.41,4.91)
  Bottom Layer w0.5: v1(26.16,12.15) 39.09,12.15 40.48,13.54 v1(40.48,36.25)
GND: length 9.4
  Top Layer w0.2: v1(7.02,40.33) 7.02,41.29 6.89,41.42 6.89,41.7 U14.3 ; v1(7.02,40.33) 7.27,40.57 U14.15 ; v1(7.02,40.33) 7.27,40.07 U14.11 ; FPC2.5 FPC2.6 59.44,35.15 59.44,35.92 59.63,36.11 v1(59.63,36.42) ; v1(89.09,44.05) 89.57,44.53 U15.9 ; FPC2.12 56.44,35.91 v1(56.81,36.28)
  vias: v1(2.4,65.95) v1(2.42,3.99) v1(2.78,66.98) v1(2.8,5.02) v1(2.88,64.83) v1(2.91,2.87) v1(3.31,27.78) v1(3.31,25.78) v1(3.31,23.78) v1(3.31,21.78) v1(3.99,67.53) v1(3.99,64.35) v1(4.01,5.57) v1(4.01,2.41) v1(5.05,67.13) v1(5.15,64.84) v1(5.08,5.17) v1(5.18,2.88) v1(5.58,65.95) v1(5.61,3.99) v1(8.81,69.28) v1(8.81,68.28) v1(8.81,67.28) v1(8.81,66.28) v1(8.81,65.28) v1(8.81,64.28) v1(14.87,31.5) v1(16.35,31.48) v1(18.02,56.19) v1(18.02,54.79) v1(18.02,53.39) v1(19.42,56.19) v1(19.42,54.79) v1(19.42,53.39) v1(20.82,56.19) v1(20.82,54.79) v1(20.82,53.39) v1(25.31,31.78) v1(25.49,33.12) v1(33.31,69.28) v1(33.31,68.28) v1(33.31,67.28) v1(33.31,66.28) v1(33.31,65.3) v1(33.31,64.28) v1(61.31,45.78) v1(63.31,45.78) v1(73.31,55.78) v1(75.31,55.78) v1(81.31,50.9) v1(85.31,53.78) v1(87.31,53.78) v1(87.58,45.38) v1(87.58,44.06) v1(89.08,45.36) v1(89.31,61.78) v1(89.31,59.78) v1(89.31,57.78) v1(92.7,46.79) v1(93.93,46.79) v1(94.36,66.04) v1(94.41,3.91) v1(94.74,67.07) v1(94.84,64.93) v1(94.79,4.94) v1(94.89,2.78) v1(95.95,67.63) v1(95.95,64.45) v1(96,5.5) v1(96,2.3) v1(97.01,67.23) v1(97.11,64.94) v1(97.07,5.1) v1(97.16,2.79) v1(97.55,66.04) v1(97.6,3.91)
VCC: length 378.1
  Top Layer w0.2: C33.2 5.51,40.08 U14.7 U14.8 ; R30.2 35.58,50.65 v1(36.87,50.65)
  Top Layer w0.3: R14.2 R13.2 76.99,50.86 v1(77.01,50.84) ; v1(83.23,50.92) 83.23,52.68 R12.2 ; v1(2.52,44.21) 5.97,44.21 R8.2 ; R15.2 81.29,52.69 80.54,53.45 C14.1 80.12,55.98 CARD1.4 v1(80.11,57.99) ; R31.2 87.08,27.07 v1(85.83,27.07) ; U11.2 11.88,61.23 v1(5.27,61.23) ; v1(59.53,37.51) C23.2 60.46,35.16 FPC2.4 FPC2.3 ; v1(53.47,37.5) 53.94,37.02 FPC2.17 ; U15.8 92.17,44.03 C37.1 92.17,42.86 92.57,42.47 94.57,42.47 95.01,42.91 95.01,47.61 94.14,48.48 v1(92.87,48.48) 92.86,48.47 C35.1 89.56,48.45 U15.13 ; R28.2 87.09,10.55 v1(85.83,10.55) ; R29.2 36.69,47.44 v1(36.87,47.61) ; v1(85.83,18.82) 87.08,18.82 R27.2 ; 61.38,60.1 v1(58.61,60.1) 55.78,60.1 ; v1(4.01,38.59) C33.2 ; 9.93,59.14 9.26,59.14 v1(8.88,58.77) ; R32.2 87.04,35.42 v1(85.81,35.42)
  Top Layer w0.5: 28.93,20.05 U13.4 ; 28.93,20.05 U13.2 ; 28.93,20.05 29.03,20.14 C7.1 29.03,28.49 C8.2 29.06,29.3 v1(28.68,29.69)
  PWR w0.3: v1(36.87,50.65) v1(36.87,47.61) 36.87,36.34 38.3,34.91 48.23,34.91 50.79,37.47 53.47,37.47 ; 83.23,50.83 82.7,50.3 77.56,50.3 v1(77.01,50.84) 77,50.84 77,38.4 76.11,37.51 v1(59.53,37.51) 53.48,37.51 v1(53.47,37.5) ; 83.23,50.83 v1(83.23,50.92) 92.57,50.92 92.87,50.62 v1(92.87,48.48) ; 83.23,50.83 83.23,37.99 v1(85.81,35.42) 85.81,27.09 v1(85.83,27.07) v1(85.83,18.82) v1(85.83,10.55) ; v1(53.47,37.5) 53.47,37.47 ; v1(53.47,37.5) 53.47,56.2 54.31,57.04 57.82,57.04 58.66,57.88 58.66,60.05 v1(58.61,60.1) 63.92,60.1 66.03,57.99 v1(80.11,57.99) ; UART.1 4.07,17.81 5.22,17.81 5.75,18.34 5.75,36.84 v1(4.01,38.59) ; 53.47,37.47 53.47,31 52.16,29.69 v1(28.68,29.69) 28.68,37.54 27.63,38.59 v1(4.01,38.59) ; v1(4.01,38.59) 3.15,38.59 2.52,39.22 v1(2.52,44.21) 2.52,60.71 3.05,61.23 v1(5.27,61.23) 5.27,59.29 5.79,58.77 v1(8.88,58.77)
DTR: length 16.6
  Top Layer w0.2: 21.41,26.06 25.23,26.06 25.66,26.48 25.66,28 25.66,28 25.66,30.27 26.19,30.8 29.93,30.8 30.35,31.22 30.35,32.41 R5.1 30.33,33.86 30.14,34.04 29.72,34.04
EN: length 130.8
  Top Layer w0.2: C40.2 6.81,59.95 v1(8.23,59.95) 11.9,59.95 U11.3 ; C31.2 90.16,21.7 90.16,20.41 89.42,19.67 RST.1 89.35,17.95 R27.1 35.84,17.95 34.96,18.83 34.96,35.12 34.01,36.06 Q1.3 30.26,36.06 v1(30.14,36.19)
  Bottom Layer w0.2: v1(30.14,36.19) 9.14,36.19 8.23,37.09 v1(8.23,59.95)
I2C_SCL: length 76.7
  Top Layer w0.2: U15.23 86.3,44.03 81.2,44.03 80.82,44.41 v1(80.82,49.17) ; R30.1 34.68,49.79 34.65,49.77 ; FPC2.13 55.94,48.71 v1(55.45,49.21) 54.89,49.77 34.65,49.77 ; U11.28 34.65,49.77
  Bottom Layer w0.2: v1(55.45,49.21) 80.78,49.21 v1(80.82,49.17)
I2C_SDA: length 75.3
  Top Layer w0.2: 34.65,48.53 v1(54.86,48.53) 55.44,47.94 FPC2.14 ; 34.65,48.53 34.68,48.5 R29.1 ; 34.65,48.53 29.95,48.53 U11.27 ; U15.24 80.98,43.53 80.25,44.26 v1(80.25,47.89)
  Bottom Layer w0.2: v1(54.86,48.53) 79.61,48.53 v1(80.25,47.89)
IO0: length 102.3
  Top Layer w0.2: v1(84.46,9.68) R28.1 89.37,9.68 BOOT.1 89.42,11.3 90.17,12.05 90.17,13.26 C32.2 ; U11.25 29.92,42.46 28.76,41.3 28.76,36.04 Q2.3 29.15,36.02 29.45,36.32 29.45,36.79 29.59,36.93 34.67,36.93 35.36,36.23 35.36,19 35.67,18.69 v1(84.43,18.69)
  Bottom Layer w0.2: v1(84.43,18.69) 84.43,9.71 v1(84.46,9.68)
IO12_I2S_SPK_BCLK: length 7.9
  Top Layer w0.2: U11.14 9.68,45.96 9.31,45.59 9.31,41.32 9.07,41.07 U14.16
IO13_I2S_SPK_LRCK: length 11.7
  Top Layer w0.2: U14.14 8.52,40.08 9.44,40.08 9.67,40.3 9.67,42.31 9.81,42.46 15.83,42.46 16.47,43.1 U11.16
IO14_I2S_SPK_DOUT: length 9.2
  Top Layer w0.2: U11.13 9.17,47.23 8.9,46.96 8.9,42.15 8.58,41.83 U14.1
IO15_MPU_INIT: length 70.3
  Top Layer w0.2: U15.12 90.99,46.03 91.29,46.33 v1(91.29,47.3) ; U11.23 25.36,45.7 v1(26.68,47.02)
  Bottom Layer w0.2: v1(26.68,47.02) 82.12,47.02 82.88,47.78 90.81,47.78 v1(91.29,47.3)
IO21_WS: length 16.9
  Top Layer w0.2: v1(35.76,56.09) 35.76,62.11 36.5,62.84 40.34,62.84 WS.3 ; U11.33 v1(33.18,56.12)
  Bottom Layer w0.2: v1(35.76,56.09) 35.74,56.12 v1(33.18,56.12)
IO25_TP_INT: length 57.4
  Top Layer w0.2: FPC2.16 54.45,35.15 54.45,37.87 53.98,38.34 v1(51.96,38.34) ; v1(16.31,51.07) 11.95,51.07 U11.10
  Bottom Layer w0.2: v1(16.31,51.07) 16.85,51.07 17.6,50.32 17.6,38.87 18.13,38.34 v1(51.96,38.34)
IO26_LCD_DC: length 63.3
  Top Layer w0.2: v1(16.32,50.23) 14.72,50.23 14.25,49.77 U11.11 ; FPC2.7 58.94,34.05 v1(58.94,34.05)
  Bottom Layer w0.2: v1(58.94,34.05) 52.17,34.05 51.66,34.56 51.66,37.16 50.98,37.84 17.52,37.84 17.07,38.29 17.07,49.78 16.61,50.23 v1(16.32,50.23)
IO27_LCD_RST: length 62
  Top Layer w0.2: FPC2.11 56.94,33.49 v1(56.98,33.46) ; U11.12 14.28,48.5 15.18,49.4 v1(16.31,49.4)
  Bottom Layer w0.2: v1(16.31,49.4) 16.31,37.94 16.89,37.35 50.67,37.35 51.26,36.77 51.26,34.09 51.9,33.46 v1(56.98,33.46)
IO32_LED: length 91.1
  Top Layer w0.2: v1(37.86,60.09) 50.18,60.09 50.18,60.1 50.18,54.85 50.85,54.19 v1(68.95,54.19) ; v1(9.89,57.4) 9.89,54.09 10.41,53.58 U11.8 ; Q7.1 67,37.61 67.02,37.62 68.57,37.62 68.96,38.02 v1(68.96,50.86)
  Bottom Layer w0.2: v1(9.89,57.4) 12.59,60.09 v1(37.86,60.09) ; v1(68.95,54.19) 68.96,54.18 v1(68.96,50.86)
IO33_TP_RST: length 58.5
  Top Layer w0.2: v1(52.44,39.06) 54.34,39.06 54.97,38.43 54.97,35.17 FPC2.15 ; v1(16.26,51.9) 14.88,51.9 14.47,52.31 U11.9
  Bottom Layer w0.2: v1(16.26,51.9) 17.19,51.9 18.21,50.88 18.21,39.97 19.12,39.06 v1(52.44,39.06)
IO34_BTN1: length 113.6
  Top Layer w0.2: v1(14.27,61.26) 14.27,56.91 13.47,56.12 U11.6 ; C39.2 90.19,38.56 90.19,37.64 89.42,36.87 IO34.1 89.32,34.49 R32.1 87.01,34.41 71.6,34.41 70.82,35.19 v1(70.82,50.92)
  Bottom Layer w0.2: v1(70.82,50.92) 70.82,60.87 69.63,62.06 15.07,62.06 v1(14.27,61.26)
IO35_BTN2: length 121.3
  Top Layer w0.2: v1(69.88,50) 69.88,27.48 71.18,26.18 87.05,26.18 R31.1 89.33,26.22 IO35.1 89.42,28.28 90.17,29.03 90.17,30.14 C38.2 ; U11.7 13.87,54.85 15.21,56.19 v1(15.21,61.25)
  Bottom Layer w0.2: v1(15.21,61.25) 69.06,61.25 69.88,60.43 v1(69.88,50)
LCD_BLK: length 2.7
  Top Layer w0.2: FPC2.2 61.43,35.16 61.43,36.64 61.98,37.19 61.98,37.66
RTS: length 18.9
  Top Layer w0.2: 33.13,34.08 33.13,34.8 32.9,35.04 29.03,35.04 28.66,34.67 28.66,32.44 28.68,32.42 28.68,31.54 28.24,31.1 26.06,31.1 25.36,30.39 25.36,28.12 24.56,27.33 U12.14
RX0: length 48.5
  Top Layer w0.2: v1(26.65,57.31) 29.84,57.31 U11.34 ; 12.09,28.66 10.88,28.66 10.41,29.12 10.41,39.95 11.41,40.95 v1(25.85,40.95)
  Bottom Layer w0.2: v1(26.65,57.31) 25.85,56.51 v1(25.85,40.95)
SPI_CS_LCD: length 54.3
  Top Layer w0.2: v1(33.96,54.15) 33.96,59.52 33.55,59.93 U11.36 ; v1(58.75,51.05) 58.75,36.42 58.46,36.12 58.46,35.16 FPC2.8
  Bottom Layer w0.2: v1(33.96,54.15) 34.78,54.97 58.07,54.97 58.75,54.28 v1(58.75,51.05)
SPI_CS_SD: length 56.5
  Top Layer w0.2: U11.37 33.67,61.2 34.61,60.26 34.61,54.77 35.81,53.57 76.98,53.57 R13.1 76.99,54.31 77.4,54.72 77.76,54.72 77.91,54.87 CARD1.2
SPI_MISO: length 62.3
  Top Layer w0.2: CARD1.7 83.42,55.98 83.42,54.91 83.24,54.73 R12.1 83.26,53.55 84.06,53.55 84.33,53.28 84.33,50.87 83.32,49.86 75.65,49.86 74.92,50.59 74.92,51.23 74.54,51.62 32.32,51.62 31.74,51.04 U11.29
SPI_MOSI: length 72.9
  Top Layer w0.2: v1(78.42,51.09) 79.07,51.09 79.32,51.34 79.32,53.22 78.98,53.56 R14.1 78.55,54.19 79.03,54.67 79.03,55.97 CARD1.3 ; U11.30 32.61,52.31 32.62,52.32 v1(56.7,52.32) 74.64,52.32 v1(75.09,51.87) ; FPC2.10 57.44,50.17 v1(56.71,50.91)
  Bottom Layer w0.2: v1(56.7,52.32) 56.71,52.31 v1(56.71,50.91) ; v1(75.09,51.87) 77.65,51.87 v1(78.42,51.09)
SPI_SCLK: length 78.9
  Top Layer w0.2: v1(58.06,49.87) 58.04,49.84 58.04,35.25 FPC2.9 ; CARD1.5 81.21,54.78 81.68,54.31 R15.1 82.14,53.56 82.46,53.25 82.46,50.88 81.78,50.2 76.22,50.2 75.75,50.67 75.75,52.12 74.92,52.96 v1(57.94,52.96) 32.44,52.96 31.82,53.58 U11.31
  Bottom Layer w0.2: v1(57.94,52.96) 58.06,52.84 v1(58.06,49.87)
TX0: length 92.1
  Top Layer w0.2: TX0.1 61.38,65.04 62.59,65.04 63,64.62 v1(63,59.23) ; 31.9,58.66 29.92,58.66 U11.35 29.87,58.61 v1(26.29,58.61) ; 31.9,58.66 v1(31.91,58.66) ; 31.9,58.66 31.89,58.67 ; 12.09,27.34 10.74,27.34 10.11,27.98 10.11,40.97 10.95,41.82 v1(25.17,41.82)
  Bottom Layer w0.2: v1(31.91,58.66) 62.43,58.66 v1(63,59.23) ; v1(26.29,58.61) 25.17,57.48 v1(25.17,41.82)
UART_RX: length 48.8
  Top Layer w0.2: v1(11.89,35.22) 25.66,35.22 26.63,36.19 U11.24
  Bottom Layer w0.2: v1(11.89,35.22) 8.67,35.22 7.48,34.03 7.48,17.26 6.83,16.61 UART.2
UART_TX: length 55.1
  Top Layer w0.2: U11.26 28.3,47.23 27.62,46.55 27.62,36.39 25.7,34.47 v1(12.64,34.47)
  Bottom Layer w0.2: v1(12.64,34.47) 8.84,34.47 8.13,33.76 8.13,16.55 6.94,15.36 UART.3
USB_DN: length 24.4
  Top Layer w0.122: 18.47,6.83 18.47,7.78 18.62,7.94 19.31,7.94 19.47,7.78 ; 19.47,7.78 19.47,9.31 arc(19.4,9.47) 19.23,9.54 arc(19.07,9.61) 19,9.78 19,9.81 arc(19.07,9.97) 19.23,10.04 arc(19.4,10.11) 19.47,10.28 19.47,10.31 arc(19.4,10.47) 19.23,10.54 arc(19.07,10.61) 19,10.78 19,10.81 arc(19.07,10.97) 19.23,11.04 arc(19.4,11.11) 19.47,11.28 19.47,11.31 arc(19.4,11.47) 19.23,11.54 arc(19.07,11.61) 19,11.78 19,11.81 arc(19.07,11.97) 19.23,12.04 arc(19.4,12.11) 19.47,12.28 19.47,23.23 18.68,24.02 16.42,24.02 16.39,23.99 16.14,23.99 U12.6 ; 19.47,7.78 19.47,6.83
USB_DP: length 24.4
  Top Layer w0.122: U12.5 15.67,24.65 16,24.32 16.14,24.32 16.15,24.33 16.27,24.33 16.28,24.34 18.81,24.34 19.79,23.36 19.79,8.33 19.97,8.15 19.97,5.84 19.87,5.75 19.14,5.75 18.97,5.91 18.97,6.83
$1N1362: length 2.3
  Top Layer w0.2: 18,9.09 18,6.86 17.97,6.83
$1N1363: length 2.2
  Top Layer w0.2: 20.96,9.07 20.96,6.84 20.97,6.83
$1N1374: length 2.7
  Top Layer w0.2: R4.1 13.01,28.6 U12.2
$1N1375: length 2.7
  Top Layer w0.2: U12.3 15.66,27.34 R3.1
$1N1380: length 2.5
  Top Layer w0.2: C4.2 13.14,26.06 15.67,26.06
$1N1392: length 1.7
  Top Layer w0.2: 31.19,32.44 31.23,32.48 Q1.1
$1N1393: length 1.6
  Top Layer w0.2: R6.2 27.82,32.46 Q2.1
$1N2490: length 2.5
  Top Layer w0.2: TX0.2 61.38,63.43 R23.2
$1N2494: length 2.5
  Top Layer w0.2: PWR.2 55.78,63.43 R16.2
$1N4073: length 1.5
  Top Layer w0.2: R19.1 63.48,38.53 Q7.3
$1N4390: length 1.7
  Top Layer w0.2: U14.2 7.27,42.59 7.55,42.88 7.55,43.36
$1N4392: length 1.7
  Top Layer w0.2: 6.27,41.83 6.27,42.48 5.99,42.77 5.99,43.36
$1N4396: length 9.5
  Top Layer w0.2: U14.10 6.77,32.31 6.33,31.87 U9.1
$1N4397: length 7.5
  Top Layer w0.2: U14.9 6.27,33.94 5.45,33.12 U9.2
$1N4657: length 1.7
  Top Layer w0.2: U15.20 86.29,45.52 C34.2
$1N4869: length 2
  Top Layer w0.2: C36.2 91.22,45.3 90.95,45.03 U15.10
$1N6267: length 2.5
  Top Layer w0.2: IO32.2 50.18,63.43 R33.2

## Copper pours and planes (outline as drawn; the poured copper is in the pictures)
+5V on Top Layer: 20.55,33.91 20.55,29.26 23.93,29.26 23.93,30.5 21.83,30.5 21.83,34 21.73,34.09 20.73,34.09
GND on Top Layer: -13.19,81.28 113.81,81.28 113.81,-12.22 -13.19,-12.22
GND on Bottom Layer: -14.69,80.78 112.31,80.78 112.31,-12.72 -14.69,-12.72
GND on GND: -4.19,80.78 122.81,80.78 122.81,-12.72 -4.19,-12.72
GND on PWR: -10.69,83.28 116.31,83.28 116.31,-10.22 -10.69,-10.22
VCC on Top Layer: 27.91,20.05 29.03,21.16 30.14,20.05

Small or netless copper shapes (teardrops, artwork), in the pictures only: 2 on Top Layer

## Text on the board
Top Silkscreen Layer: Speaker | 3V3 | RX | TX | GND | esp32-develop-board-v1.0 | + | - | Author: / myry
